# Altium schematic sheet FPGA_34.SchDoc: SPEC-A7
size 420 x 297 mm; Author: G.Kasprowicz; CompanyName: WUT ISE; DrawnBy: G.Kasprowicz; Organization: WUT ISE; Address1: PW ISE; Address2: Nowowiejska 15/19 00-665 Warsaw; Address3: gkasprow@gmail.com; Revision: 2; SheetNumber: 4; SheetTotal: 18; ModifiedBy: -; CheckedDate: -; Title2: FPGA 34; DivGrp: WUT ISE; Designer: G.Kasprowicz; ModifiedDate: -; ProjectName: Sensor Box
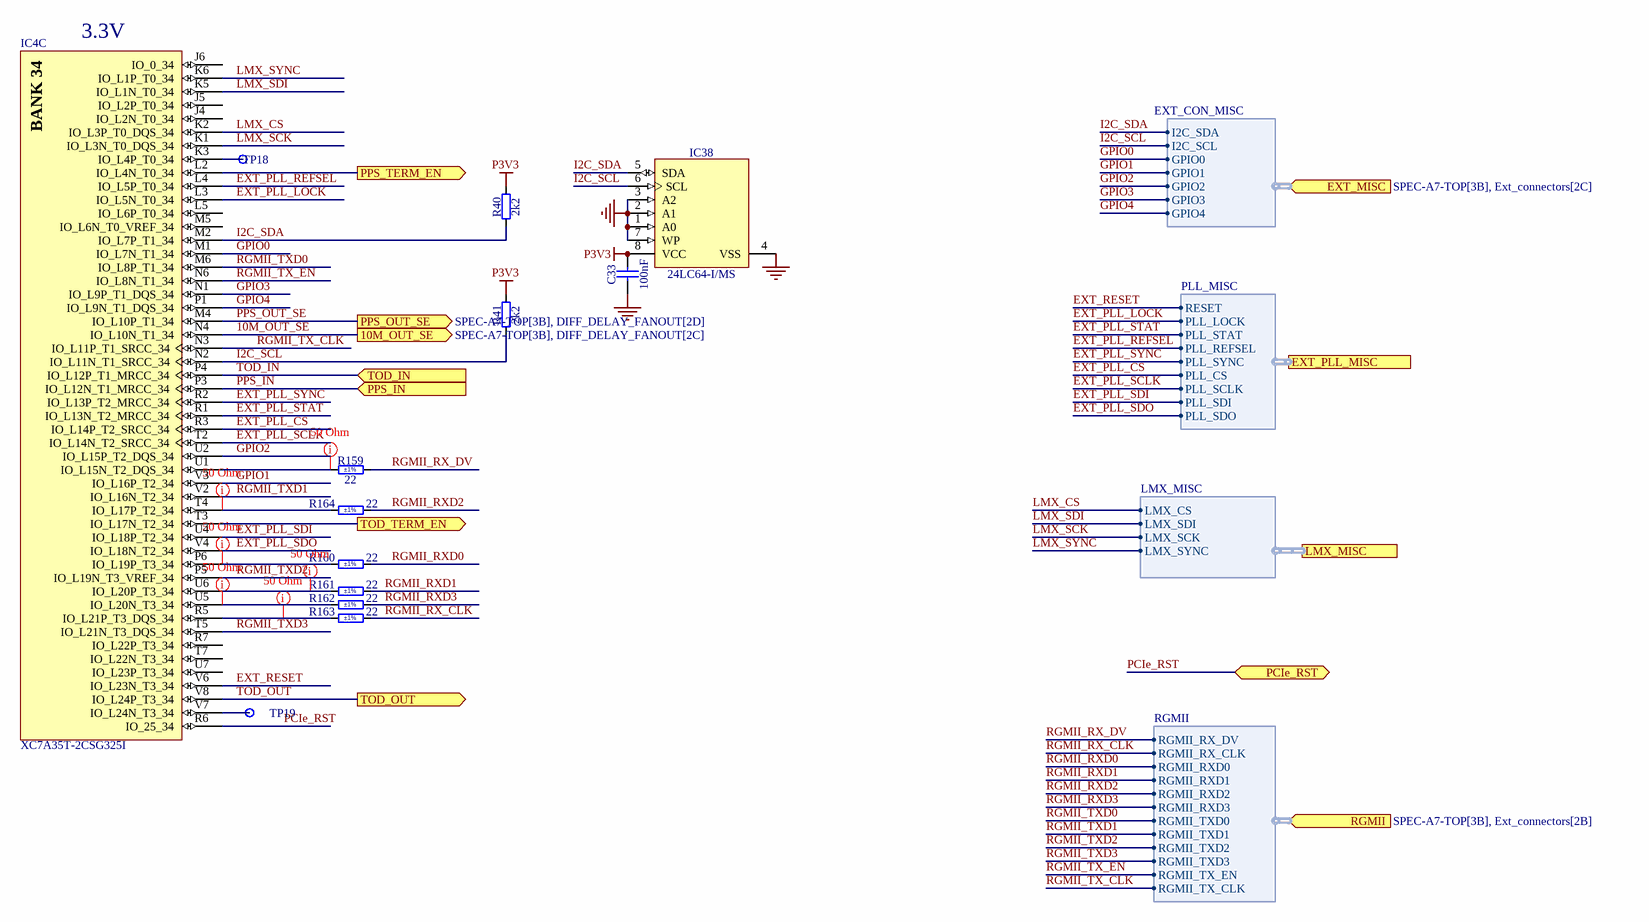
[diagram p0: FPGA_34.SchDoc]

## Parts
C33  100nF  [CAPC0603X33N]
IC4  XC7A35T-2CSG325I  [CSG325]  (part C of 9)
IC38  24LC64-I/MS  [SOP65P490X110-8N]
R40  2k2  [RESC1005X40N]
R41  2k2  [RESC1005X40N]
R159  22  Tolerance: ±1%  [RESC1005X40N]
R160  22  Tolerance: ±1%  [RESC1005X40N]
R161  22  Tolerance: ±1%  [RESC1005X40N]
R162  22  Tolerance: ±1%  [RESC1005X40N]
R163  22  Tolerance: ±1%  [RESC1005X40N]
R164  22  Tolerance: ±1%  [RESC1005X40N]
TP18  Test Point  [TPS060]  (value not drawn)
TP19  Test Point  [TPS060]  (value not drawn)

## Ports
10M_OUT_SE (out, see SPEC-A7-TOP[3B], DIFF_DELAY_FANOUT[2C]), EXT_MISC (in, harness EXT_CON_MISC, see SPEC-A7-TOP[3B], Ext_connectors[2C]), EXT_PLL_MISC (harness PLL_MISC, see SPEC-A7-TOP[3B], Clocks_PLL[5E]), LMX_MISC (harness LMX_MISC, see SPEC-A7-TOP[3B], Clocks_PLL[5D]), PCIe_RST (bidir, see SPEC-A7-TOP[3B], PCIe[1C]), PPS_IN (in, see SPEC-A7-TOP[3B], PPS_IN[4C]), PPS_OUT_SE (out, see SPEC-A7-TOP[3B], DIFF_DELAY_FANOUT[2D]), PPS_TERM_EN (out, see SPEC-A7-TOP[3B], PPS_IN[2D]), RGMII (in, harness RGMII, see SPEC-A7-TOP[3B], Ext_connectors[2B]), TOD_IN (in, see SPEC-A7-TOP[3B], TOD[3C]), TOD_OUT (out, see SPEC-A7-TOP[3B], TOD[3D]), TOD_TERM_EN (out, see SPEC-A7-TOP[3B], TOD[1C])

## Harnesses
PLL_MISC: RESET, PLL_LOCK, PLL_STAT, PLL_REFSEL, PLL_SYNC, PLL_CS, PLL_SCLK, PLL_SDI, PLL_SDO
LMX_MISC: LMX_CS, LMX_SDI, LMX_SCK, LMX_SYNC
EXT_CON_MISC: I2C_SDA, I2C_SCL, GPIO0, GPIO1, GPIO2, GPIO3, GPIO4
RGMII: RGMII_RX_DV, RGMII_RX_CLK, RGMII_RXD0, RGMII_RXD1, RGMII_RXD2, RGMII_RXD3, RGMII_TXD0, RGMII_TXD1, RGMII_TXD2, RGMII_TXD3, RGMII_TX_EN, RGMII_TX_CLK

## Nets
GND: C33.1 IC38.1(A0) IC38.2(A1) IC38.3(A2) IC38.4(VSS) IC38.7(WP)
P3V3: C33.2 IC38.8(VCC) R40.2 R41.2
10M_OUT_SE: IC4.N4(IO_L10N_T1_34) ; port 10M_OUT_SE
EXT_PLL_CS: IC4.R3(IO_L14P_T2_SRCC_34) ; port EXT_PLL_MISC.PLL_CS
EXT_PLL_LOCK: IC4.L3(IO_L5N_T0_34) ; port EXT_PLL_MISC.PLL_LOCK
EXT_PLL_REFSEL: IC4.L4(IO_L5P_T0_34) ; port EXT_PLL_MISC.PLL_REFSEL
EXT_PLL_SCLK: IC4.T2(IO_L14N_T2_SRCC_34) ; port EXT_PLL_MISC.PLL_SCLK
EXT_PLL_SDI: IC4.U4(IO_L18P_T2_34) ; port EXT_PLL_MISC.PLL_SDI
EXT_PLL_SDO: IC4.V4(IO_L18N_T2_34) ; port EXT_PLL_MISC.PLL_SDO
EXT_PLL_STAT: IC4.R1(IO_L13N_T2_MRCC_34) ; port EXT_PLL_MISC.PLL_STAT
EXT_PLL_SYNC: IC4.R2(IO_L13P_T2_MRCC_34) ; port EXT_PLL_MISC.PLL_SYNC
EXT_RESET: IC4.V6(IO_L23N_T3_34) ; port EXT_PLL_MISC.RESET
GPIO0: IC4.M1(IO_L7N_T1_34) ; port EXT_MISC.GPIO0
GPIO1: IC4.V3(IO_L16P_T2_34) ; port EXT_MISC.GPIO1
GPIO2: IC4.U2(IO_L15P_T2_DQS_34) ; port EXT_MISC.GPIO2
GPIO3: IC4.N1(IO_L9P_T1_DQS_34) ; port EXT_MISC.GPIO3
GPIO4: IC4.P1(IO_L9N_T1_DQS_34) ; port EXT_MISC.GPIO4
I2C_SCL: IC4.N2(IO_L11N_T1_SRCC_34) IC38.6(SCL) R41.1 ; port EXT_MISC.I2C_SCL
I2C_SDA: IC4.M2(IO_L7P_T1_34) IC38.5(SDA) R40.1 ; port EXT_MISC.I2C_SDA
LMX_CS: IC4.K2(IO_L3P_T0_DQS_34) ; port LMX_MISC.LMX_CS
LMX_SCK: IC4.K1(IO_L3N_T0_DQS_34) ; port LMX_MISC.LMX_SCK
LMX_SDI: IC4.K5(IO_L1N_T0_34) ; port LMX_MISC.LMX_SDI
LMX_SYNC: IC4.K6(IO_L1P_T0_34) ; port LMX_MISC.LMX_SYNC
PCIe_RST: IC4.R6(IO_25_34) ; port PCIe_RST
PPS_IN: IC4.P3(IO_L12N_T1_MRCC_34) ; port PPS_IN
PPS_OUT_SE: IC4.M4(IO_L10P_T1_34) ; port PPS_OUT_SE
PPS_TERM_EN: IC4.L2(IO_L4N_T0_34) ; port PPS_TERM_EN
RGMII_RX_CLK: R163.2 ; port RGMII.RGMII_RX_CLK
RGMII_RX_DV: R159.2 ; port RGMII.RGMII_RX_DV
RGMII_RXD0: R160.2 ; port RGMII.RGMII_RXD0
RGMII_RXD1: R161.2 ; port RGMII.RGMII_RXD1
RGMII_RXD2: R164.2 ; port RGMII.RGMII_RXD2
RGMII_RXD3: R162.2 ; port RGMII.RGMII_RXD3
RGMII_TX_CLK: IC4.N3(IO_L11P_T1_SRCC_34) ; port RGMII.RGMII_TX_CLK
RGMII_TX_EN: IC4.N6(IO_L8N_T1_34) ; port RGMII.RGMII_TX_EN
RGMII_TXD0: IC4.M6(IO_L8P_T1_34) ; port RGMII.RGMII_TXD0
RGMII_TXD1: IC4.V2(IO_L16N_T2_34) ; port RGMII.RGMII_TXD1
RGMII_TXD2: IC4.P5(IO_L19N_T3_VREF_34) ; port RGMII.RGMII_TXD2
RGMII_TXD3: IC4.T5(IO_L21N_T3_DQS_34) ; port RGMII.RGMII_TXD3
TOD_IN: IC4.P4(IO_L12P_T1_MRCC_34) ; port TOD_IN
TOD_OUT: IC4.V8(IO_L24P_T3_34) ; port TOD_OUT
TOD_TERM_EN: IC4.T3(IO_L17N_T2_34) ; port TOD_TERM_EN
NetIC4_K3: IC4.K3(IO_L4P_T0_34) TP18.1
NetIC4_P6: IC4.P6(IO_L19P_T3_34) R160.1
NetIC4_R5: IC4.R5(IO_L21P_T3_DQS_34) R163.1
NetIC4_T4: IC4.T4(IO_L17P_T2_34) R164.1
NetIC4_U1: IC4.U1(IO_L15N_T2_DQS_34) R159.1
NetIC4_U5: IC4.U5(IO_L20N_T3_34) R162.1
NetIC4_U6: IC4.U6(IO_L20P_T3_34) R161.1
NetIC4_V7: IC4.V7(IO_L24N_T3_34) TP19.1

Not connected (* = marked no-connect by the designer): IC4 J4(IO_L2N_T0_34) J5(IO_L2P_T0_34) J6(IO_0_34) L5(IO_L6P_T0_34) M5(IO_L6N_T0_VREF_34) R7(IO_L22P_T3_34) T7(IO_L22N_T3_34) U7(IO_L23P_T3_34)

## Layout directives
net class 50_Ohm: NetIC4_P6, NetIC4_R5, NetIC4_T4, NetIC4_U1, NetIC4_U5, NetIC4_U6

## Notes on the sheet
- 3.3V
- Project/Equipment
- Document
- Designer
- Drawn by
- Check.by
- Copyright WUT ISE 2024.
  This documentation describes Open Hardware and is licensed under the CERN OHL v.2. You may redistribute and modify this documentation under the terms of the CERN OHL v.2. (http://ohwr.org/CERNOHL). This documentation is distributed WITHOUT ANY EXPRESS OR IMPLIED WARRANTY, INCLUDING OF MERCHANTABILITY, SATISFACTORY QUALITY AND FITNESS FOR A PARTICULAR PURPOSE. Please see the CERN OHL v.2 for applicable conditions.
- Contact
- File
- Last Mod.
- Print Date
- Sheet
- Size
- A3
- of
- Rev
- (in symbol CMP-0383-00003-1, part C) BANK 34

## Library data of the parts
C33 = CC0201_100NF_6.3V_10%_X5R: Non-polarised capacitor; Part Description: SMD Multilayer Chip Ceramic Capacitor; Manufacturer: GENERIC; Manufacturer1 Part Number: 02016D104KAT2A; Voltage: 6.3V; TC: X5R; Tolerance: ±10%; Part Number: CC0201_100NF_6.3V_10%_X5R; Component Kind: Standard; Component Type: Standard; Pin Count: 2; Value: 100nF; Status: Not Recommended; Manufacturer Part Number: CC0201_100NF_6.3V_10%_X5R; Case: 0201; Mounted: Yes; Socket: No; SMD: Yes; Sense: No; Manufacturer1 Example: AVX; Manufacturer1 ComponentHeight: 0.33mm; HelpURL: \\cern.ch\dfs\Applications\Altium\Datasheets\CC0201_X5R_AVX.pdf; Author: CERN DEM JLC; CreateDate: 03.12.2007; LatestRevisionDate: 03.12.2007
IC4 = CMP-0383-00003-1: Artix-7 FPGA, 150 User I/Os, 4 GTP, 324-Ball BGA, Speed Grade 2, Industrial Grade, Pb-Free; Manufacturer: Xilinx; Available User I/O: 150; Speed Grades: 2; GTP: 4; Logic Cells: 33280; Total Block RAM: 1800 Kb; CMTs: 5; ComponentLink3URL: http://www.xilinx.com/support/documentation/user_guides/ug475_7Series_Pkg_Pinout.pdf; Maximum Distributed RAM: 400 Kb; Operating Temperature Range: Industrial; ComponentLink1URL: http://www.xilinx.com/; Mounting Technology: Surface Mount; ComponentLink1Description: Manufacturer URL; ComponentLink2Description: Datasheet; PartNumber: XC7A35T-2CSG325I; PackageVersion: Rev. 1.11; PackageDescription: 324-Ball Wire-Bond Chip-Scale BGA, Body 15 x 15 mm, Pitch 0.8 mm; DatasheetVersion: Rev. 1.15; PackageReference: CSG-325; ComponentLink3Description: Pinout; ComponentLink4Description: Package Specification; ComponentLink2URL: http://www.xilinx.com/support/documentation/data_sheets/ds180_7Series_Overview.pdf; ComponentLink4URL: http://www.xilinx.com/support/documentation/user_guides/ug475_7Series_Pkg_Pinout.pdf
IC38 = 24LC64-I/MS: 64K I2C Serial EEPROM; Part Description: 2.5V-5.5V, 64K (8K x 8-bit) I2C Serial EEPROM; Manufacturer: MICROCHIP TECHNOLOGY; PressFit: No; Bonding: No; Part Number: 24LC64-I/MS; Component Kind: Standard; Component Type: Standard; Device: 24LC64-I/MS; PackageDescription: SOP, 0.65mm pitch; 8 pin, 3.00mm W X 3.00mm L X 1.10mm H body, IPC Medium Density; Manufacturer Part Number: 24LC64-I/MS; Pin Count: 8; Case: MSOP8; Mounted: Yes; Socket: No; SMD: Yes; Sense: No; ComponentHeight: 1.1mm; HelpURL: \\cern.ch\dfs\Applications\Altium\Datasheets\24LC64-I-MS.pdf; Author: CERN DEM JLC; CreateDate: 24.01.2011; LatestRevisionDate: 24.01.2011
R40 R41 = R0402_2K2_1%_0.0625W_100PPM: Resistor - 1%; Part Description: General Purpose Thick Film Chip Resistor; Manufacturer: GENERIC; Manufacturer1 Part Number: 232270672202L; TC: ±100ppm/°C; PressFit: No; Part Number: R0402_2K2_1%_0.0625W_100PPM; Component Kind: Standard; Component Type: Standard; Pin Count: 2; Value: 2k2; Status: Not Recommended; Power: 0.0625W; Tolerance: ±1%; Manufacturer Part Number: R0402_2K2_1%_0.0625W_100PPM; Case: 0402; Mounted: Yes; Sense: No; Socket: No; SMD: Yes; Manufacturer1 Example: YAGEO PHYCOMP; Manufacturer1 ComponentHeight: 0.4mm; HelpURL: \\cern.ch\dfs\Applications\Altium\Datasheets\R0402_Phycomp_RC0402.pdf; Author: CERN DEM JLC; CreateDate: 03.12.2007; LatestRevisionDate: 17.10.2012
R159-R164 = R0402_22R_1%_0.0625W_100PPM: Resistor - 1%; Part Description: General Purpose Thick Film Chip Resistor; Manufacturer: GENERIC; Manufacturer1 Part Number: 232270672209L; TC: ±100ppm/°C; PressFit: No; Part Number: R0402_22R_1%_0.0625W_100PPM; Component Kind: Standard; Component Type: Standard; Pin Count: 2; Value: 22; Status: Not Recommended; Power: 0.0625W; Manufacturer Part Number: R0402_22R_1%_0.0625W_100PPM; Case: 0402; Mounted: Yes; Sense: No; Socket: No; SMD: Yes; Manufacturer1 Example: YAGEO PHYCOMP; Manufacturer1 ComponentHeight: 0.4mm; HelpURL: \\cern.ch\dfs\Applications\Altium\Datasheets\R0402_Phycomp_RC0402.pdf; Author: CERN DEM JLC; CreateDate: 03.12.2007; LatestRevisionDate: 17.10.2012
TP18 TP19 = SMD_PAD_0.6X0.6MM: Part Description: 0.6mm x 0.6mm PCB Copper Area (SMD Test Point); Mounted: No; Part Number: SMD_PAD_0.6X0.6MM; Component Kind: Standard (No BOM); Component Type: Standard (No BOM); Pin Count: 1; Family: Test Point; Socket: No; SMD: Yes; Sense: No; Status: None; ComponentHeight: 0mm; HelpURL: Undefined; Author: CERN DEM HF; CreateDate: 24.05.2023; LatestRevisionDate: 24.05.2023; PackageDescription: 0.6mm x 0.6mm PCB Copper Area (SMD Test Point)